# EAGLE design Window Dehumidifier Upgrade Board (EAGLE 7.6.0)
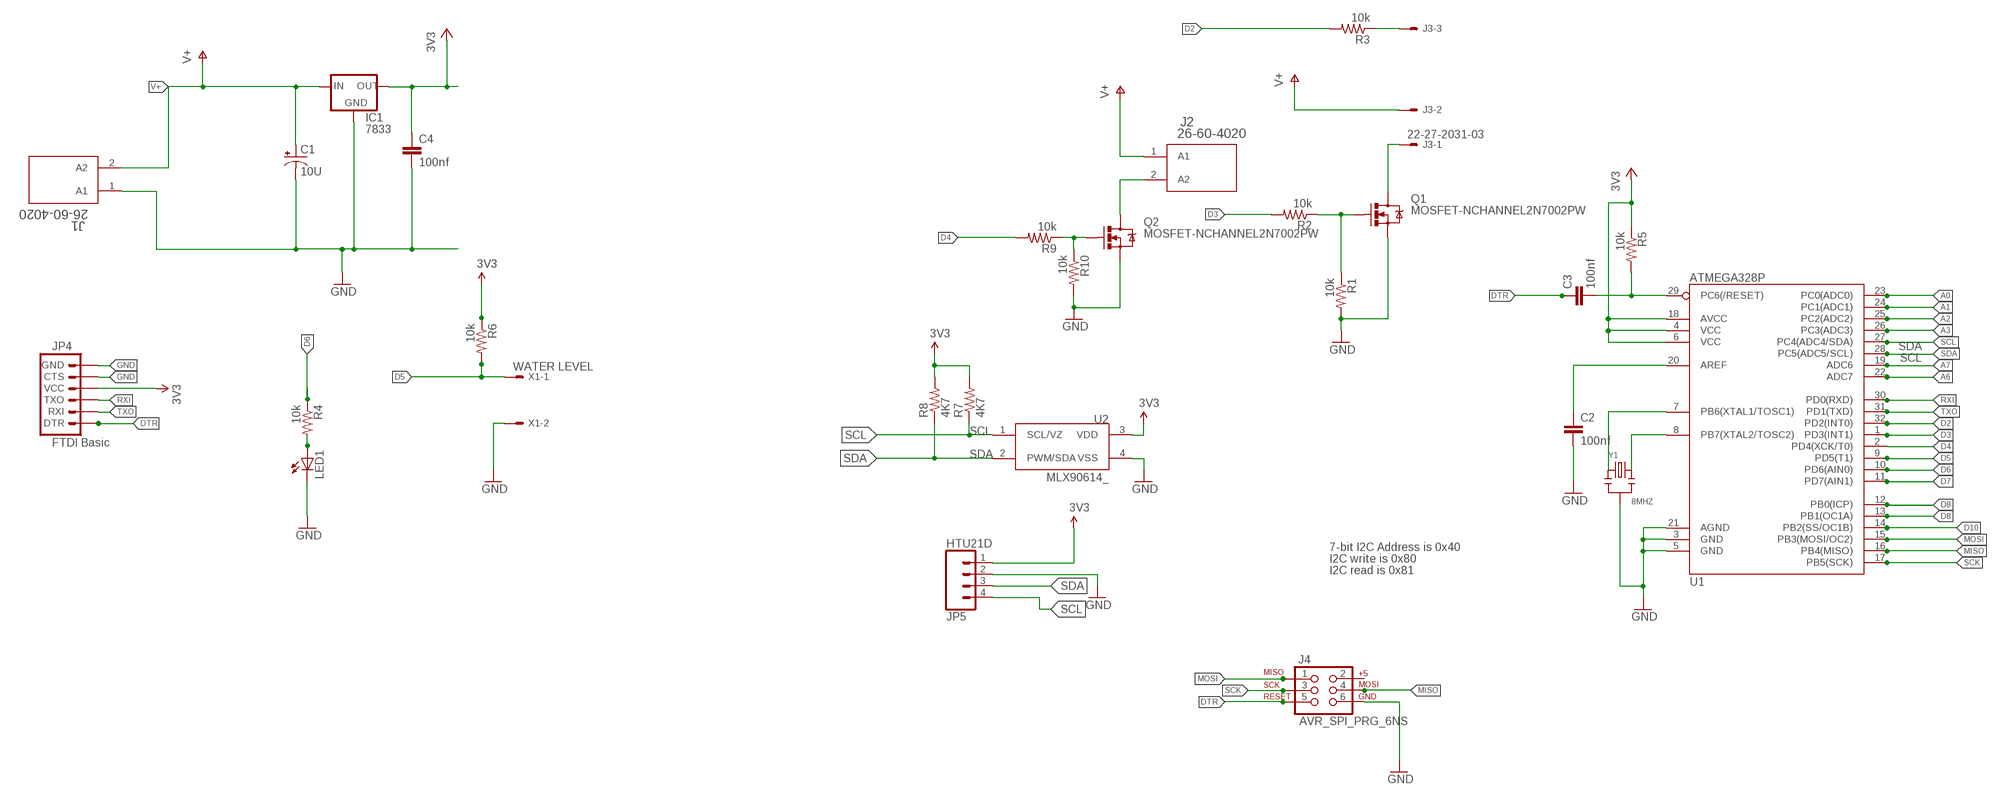
[diagram p0: schematic, sheet 1]

## Parts
C1  10U  CAP_POLPTH1  [CPOL-RADIAL-100UF-25V]
C2  100nf  CAP0805  [0805]
C3  100nf  CAP0805  [0805]
C4  100nf  CAP0805  [0805]
IC1  7833  V_REG_78XXTO-92  [TO-92]
J1  26-60-4020  [26-60-4020]
J2  26-60-4020  [26-60-4020]
J3  22-27-2031-03  [6410-03]
J4  AVR_SPI_PRG_6NS  [2X3-NS]
JP4  FTDI Basic  ARDUINO_SERIAL_PROGRAMPTH  [1X06]
JP5  HTU21D  M04PTH  [1X04]
LED1  LED3MM  [LED3MM]
Q1  MOSFET-NCHANNEL2N7002PW  [SOT323]
Q2  MOSFET-NCHANNEL2N7002PW  [SOT323]
R1  10k  RESISTOR  [0805]
R2  10k  RESISTOR  [0805]
R3  10k  RESISTOR  [0805]
R4  10k  RESISTOR  [0805]
R5  10k  RESISTOR  [0805]
R6  10k  RESISTOR  [0805]
R7  4K7  RESISTOR  [0805]
R8  4K7  RESISTOR  [0805]
R9  10k  RESISTOR  [0805]
R10  10k  RESISTOR  [0805]
U1  ATMEGA328P  ATMEGA328_SMT  [TQFP32-08]
U2  MLX90614_  [TO-39]
X1  WATER LEVEL  22-23-2021  [22-23-2021]
Y1  8MHZ  DIP-CERAMIC-RESONATOR/-OSCILLATOR-8MHZ(3P-2.5-8X3MM)  [X3-2.5-8X3X5.5MM]

## Nets
3.3V: JP4.4(VCC) ; supply symbol labelled 3V3
3V3: C4.1 IC1.3(OUT) JP5.1 R5.1 R6.1 R7.2 R8.2 U1.4(VCC) U1.6(VCC) U1.18(AVCC) U2.3(VDD)
A0: U1.23(PC0(ADC0))
A1: U1.24(PC1(ADC1))
A2: U1.25(PC2(ADC2))
A3: U1.26(PC3(ADC3))
A6: U1.22(ADC7)
A7: U1.19(ADC6)
D2: R3.2 U1.32(PD2(INT0))
D3: R2.2 U1.1(PD3(INT1))
D4: R9.2 U1.2(PD4(XCK/T0))
D5: R6.2 U1.9(PD5(T1)) X1.1
D6: R4.1 U1.10(PD6(AIN0))
D7: U1.11(PD7(AIN1))
D8: U1.12(PB0(ICP))
D9: U1.13(PB1(OC1A))
D10: U1.14(PB2(SS/OC1B))
DTR: C3.1 J4.5 JP4.1(DTR)
GND [vcc]: C1.2(-) C2.2 C4.2 IC1.1(GND) J1.1(A1) J4.6 JP4.5(CTS) JP4.6(GND) JP5.2 LED1.K(C) Q1.2(S) Q2.2(S) R1.2 R10.2 U1.3(GND) U1.5(GND) U1.21(AGND) U2.4(VSS) X1.2 Y1.2
MISO: J4.4 U1.16(PB4(MISO))
MOSI: J4.1 U1.15(PB3(MOSI/OC2))
N$3: Q2.1(G) R9.1 R10.1
N$4: J2.2(A2) Q2.3(D)
N$5: Q1.1(G) R1.1 R2.1
N$6: J3.1 Q1.3(D)
N$7: LED1.A R4.2
N$8: J3.3 R3.1
N$9: C2.1 U1.20(AREF)
N$10: C3.2 R5.2 U1.29(PC6(/RESET))
N$11: U1.7(PB6(XTAL1/TOSC1)) Y1.1
N$12: U1.8(PB7(XTAL2/TOSC2)) Y1.3
RXI: JP4.3(TXO) U1.30(PD0(RXD))
SCK: J4.3 U1.17(PB5(SCK))
SCL: JP5.4 R7.1 U1.28(PC5(ADC5/SCL)) U2.1(SCL/VZ)
SDA: JP5.3 R8.1 U1.27(PC4(ADC4/SDA)) U2.2(PWM/SDA)
TXO: JP4.2(RXI) U1.31(PD1(TXD))
V+: C1.1(+) IC1.2(IN) J1.2(A2) J2.1(A1) J3.2
Unconnected: J4.2

## Notes on the sheet
- 7-bit I2C Address is 0x40
- I2C write is 0x80
- I2C read is 0x81

## Library data of the parts
C1 = SparkFun-Passives:CAP_POL: Capacitor Polarized These are standard SMD and PTH capacitors. Normally 10uF, 47uF, and 100uF in electrolytic and tantalum varieties. Always verify the external diameter of the through hole cap, it varies with capacity, voltage, and manufacturer. The EIA devices should be standard.
C2-C4 = SparkFun-Passives:CAP: Capacitor Standard 0603 ceramic capacitor, and 0.1" leaded capacitor.
IC1 = SparkFun-PowerIC:V_REG_78XX: Voltage Regulator Standard 7805 5V regulator. IGO (Input Ground Output). Spark Fun Electronics SKU : COM-00107
J1 J2 = Molex 26604020:26-60-4020; MANUFACTURER_PART_NUMBER: 26604020; VENDOR: Tyco Electronics
J3 = con-molex:22-?-03: CONNECTOR wire to board 2.54 mm (.1 inch) pitch header; OC_FARNELL: unknown; OC_NEWARK: unknown
J4 = SparkFun-Connectors:AVR_SPI_PRG_6: AVR ISP 6 Pin This is the reduced ISP connector for AVR programming. Common on Arduino. This footprint will take up less PCB space and can be used with a 10-pin to 6-pin adapter such as SKU: BOB-08508
JP4 = SparkFun:ARDUINO_SERIAL_PROGRAM
JP5 = SparkFun-Connectors:M04: Header 4 Standard 4-pin 0.1" header. Use with straight break away headers (SKU : PRT-00116), right angle break away headers (PRT-00553), swiss pins (PRT-00743), machine pins (PRT-00117), and female headers (PRT-00115). Molex polarized connector foot print use with SKU : PRT-08231 with associated crimp pins and housings. 1MM SMD Version SKU: PRT-10208
LED1 = SparkFun-LED:LED: LEDs Standard schematic elements and footprints for 5mm, 3mm, 1206, and 0603 sized LEDs. 5mm - Spark Fun Electronics SKU : COM-00529 (and others)
Q1 Q2 = SparkFun-DiscreteSemi:MOSFET-NCHANNEL: Common NMOSFET Parts MFG P/N Store ID Prod ID FDD8780 TRANS-09984 SI7820DN TRANS-11055 FDS6630A IC-08089 2N7002PW TRANS-11151 FQP30N06L COM-10213 TRANS-10060 BSS123LT1G TRANS-08345 BSS138 TRANS-00830 BS170 2N7000; PROD_ID: TRANS-11151
R1-R10 = SparkFun:RESISTOR: Resistor Basic schematic elements and footprints for 0603, 1206, and PTH 1/10th watt (small) resistors.
U1 = SparkFun-DigitalIC:ATMEGA328_SMT: 32-Pin Atmega328 part Commonly used on Arduino compatible boards Available in QFP and QFN packages TQFP is IC-09069 QFN is non-stock; PROD_ID: IC-09069
U2 = SparkFun-Sensors:MLX90614: Non-contact PIR I2C interface temperature sensor
X1 = con-molex:22-23-2021: .100" (2.54mm) Center Header - 2 Pin; MF: MOLEX; MPN: 22-23-2021; OC_FARNELL: 1462926; OC_NEWARK: 25C3832
Y1 = Seeed-OPL-Crystal-Oscillator:DIP-CERAMIC-RESONATOR/-OSCILLATOR-8MHZ(3P-2.5-8X3MM): 306030010; MPN: CSTLS8M00G53Z-A0

## Net classes
0 default: width 0.203 mm
1 vcc: width 0.254 mm

## Board
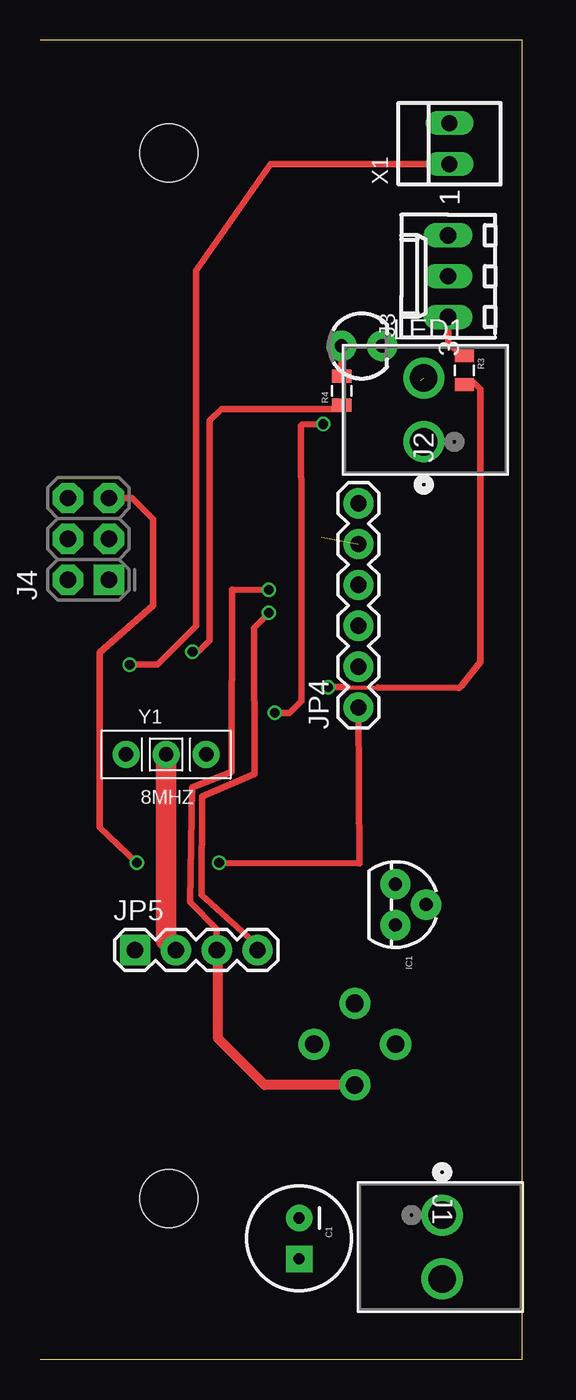
[diagram p1: board, top side]
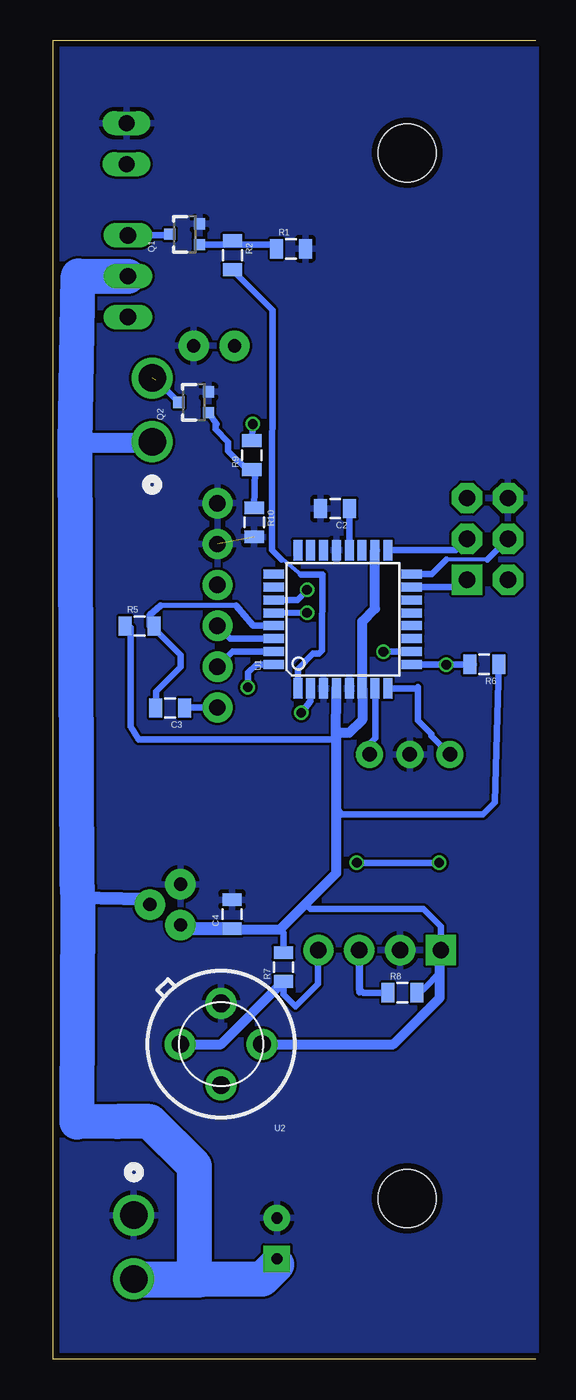
[diagram p2: board, bottom side, seen from below]

Size 30 x 82 mm. Coordinates in mm from the lower left corner, seen from the top.
Outline: 0,0 30,0 30,82 0,82
Copper layers (1*16): Top 0.035559375mm / dielectric 1.6mm / Bottom 0.035559375mm
Design rules "oshpark-2layer": minimum track width 6mil, minimum drill 10mil, track to track 6mil, track to pad 6mil, pad to pad 6mil, via to via 6mil, smd to smd 6mil, copper to edge 15mil, drill to drill 6mil, minimum pad ring 5mil, minimum via ring 5mil, stop-mask expansion 2.5mil, vias tented up to drill 0mil, thermal gap 10mil
Holes 3.6 mm at 8,10 8,75

### Footprints (pad centres in the part's own frame; a part is rotated, then mirrored left to right if it is on the bottom)
CPOL-RADIAL-100UF-25V = drill 0.7 pad 1.651 square: 1 1.27,0 | drill 0.7 pad 1.651: 2 -1.27,0
0805 = smd 0.8 x 1.2: 1 -0.9,0; 2 0.9,0
TO-92 = drill 0.813 pad 1.88: 1 -1.27,0; 2 0,1.905; 3 1.27,0
26-60-4020 = drill 1.702 pad 2.21: 1 -3.962,0; 2 0,0
6410-03 = drill 1.016 long: 1 2.54,0; 2 0,0; 3 -2.54,0
2X3-NS = drill 1.016 pad 1.88 square: 1 -2.54,-1.27 | drill 1.016 pad 1.88 octagon: 2 -2.54,1.27; 3 0,-1.27; 4 0,1.27; 5 2.54,-1.27; 6 2.54,1.27
1X06 = drill 1.016 pad 1.88: 1 0,0; 2 2.54,0; 3 5.08,0; 4 7.62,0; 5 10.16,0; 6 12.7,0
1X04 = drill 1.016 pad 1.88 square: 1 0,0 | drill 1.016 pad 1.88: 2 2.54,0; 3 5.08,0; 4 7.62,0
LED3MM = drill 0.813 pad 1.88: A -1.27,0; K 1.27,0
SOT323 = smd 0.7 x 0.7: 1 -0.65,-0.925; 2 0.65,-0.925; 3 0,0.925
TQFP32-08 = smd 1.27 x 0.559: 1 -4.293,2.8; 2 -4.293,2; 3 -4.293,1.2; 4 -4.293,0.4; 5 -4.293,-0.4; 6 -4.293,-1.2; 7 -4.293,-2; 8 -4.293,-2.8; 17 4.293,-2.8; 18 4.293,-2; 19 4.293,-1.2; 20 4.293,-0.4; 21 4.293,0.4; 22 4.293,1.2; 23 4.293,2; 24 4.293,2.8 | smd 0.559 x 1.27: 9 -2.8,-4.293; 10 -2,-4.293; 11 -1.2,-4.293; 12 -0.4,-4.293; 13 0.4,-4.293; 14 1.2,-4.293; 15 2,-4.293; 16 2.8,-4.293; 25 2.8,4.293; 26 2,4.293; 27 1.2,4.293; 28 0.4,4.293; 29 -0.4,4.293; 30 -1.2,4.293; 31 -2,4.293; 32 -2.8,4.293
TO-39 = drill 1.1 pad 1.93: 1 2.54,0; 2 0,2.54; 3 -2.54,0; 4 0,-2.54
22-23-2021 = drill 1 long: 1 -1.27,0; 2 1.27,0
X3-2.5-8X3X5.5MM = drill 0.9 pad 1.676: 1 2.5,0; 2 0,0; 3 -2.5,0

### Placement (x,y rotation side)
C1  16.1,7.51 270 top
C2  12.48,52.89 180 bottom
C3  22.74,40.49 180 bottom
C4  18.89,27.67 90 bottom
IC1  22.1,28.26 270 top
J1  25,5 270 top
J2  23.86,61 90 top
J3  25.37,67.33 90 top
J4  3,51 90 top
JP4  19.8,40.52 90 top
JP5  5.9,25.44 0 top
LED1  20,63 0 top
Q1  21.83,69.94 90 bottom
Q2  21.27,59.5 90 bottom
R1  15.23,69.04 0 bottom
R2  18.86,68.64 270 bottom
R3  26.38,61.48 270 top
R4  18.74,60.21 90 top
R5  24.64,45.59 0 bottom
R6  3.21,43.2 180 bottom
R7  15.68,24.38 90 bottom
R8  8.29,22.79 0 bottom
R9  17.65,56.2 90 bottom
R10  17.51,52.03 270 bottom
U1  12,46 90 bottom
U2  19.57,19.59 180 bottom
X1  25.46,75.57 90 top
Y1  7.83,37.6 0 top

### Tracks (layer width: path | path; a pad name or v marks a point on that pad's centre or on a via)
3V3
  Bottom 0.406: R5.1 25.2,45.49 25.2,39.34 24.69,38.53 12.43,38.53 | 9.98,50.31 U1.18 | R6.1 2.56,34.6 3.28,33.88 12.02,33.88 12.4,34.27 | 22.33,26.76 IC1.3 | R7.2 15.68,26.5 15.9,26.72 | R8.2 7.43,23 7,23 5.9,24.1 JP5.1 5.9,26.9 7,28 14,28 14.31,28.31
  Bottom 0.61: C4.1 18.84,26.72 15.9,26.72 14.31,28.31 12.4,30.22 12.4,34.27 12.4,38.94 | 12.4,38.94 12.43,38.53 U1.4 | 12.4,38.94 11.61,38.94 10.79,39.75 U1.6 10.79,45.87 10,46.67 U1.18 | U2.3 8.86,19.59 5.97,22.48 5.97,25.37 JP5.1
  Bottom 0.813: IC1.3 21.87,26.77 C4.1
D2  (via drill 0.6)
  Top 0.254: 19.11,41.77 21.01,41.77
  Top 0.406: R3.2 26.96,60.73 27.38,60.31 27.38,43.89 | 27.38,43.89 27.38,43.64 | 26.11,41.76 26.19,41.86 | 26.19,41.86 27.37,43.34 27.37,43.73 27.38,43.89 | 26.19,41.86 26.11,41.78 26.04,41.73 21.01,41.77 | v17.91,41.78 19.13,41.78 19.11,41.77
  Bottom 0.406: U1.32 17.38,43.2 17.88,42.7 17.88,41.81 v17.91,41.78
D3
  Bottom 0.254: 15.82,49.71 15.75,49.73 14.61,48.79
  Bottom 0.406: R2.2 18.86,67.7 16.38,65.23 16.41,50.32 15.82,49.71 | 14.61,48.79 13.26,48.79 13.28,44.07 13.49,43.87 13.84,43.87 14.78,42.93 14.78,41.73 U1.1
D4  (via drill 0.6)
  Top 0.406: v14.58,40.18 15.52,40.18 16.26,40.92 16.26,51.54 16.23,58.04 16.28,58.12 v17.6,58.14
  Bottom 0.406: 13.92,41.66 13.97,41.71 U1.2 14,40.91 v14.58,40.18 | v17.6,58.14 17.6,58.05 R9.2
D5  (via drill 0.6)
  Top 0.406: v5.56,43.18 7.32,43.18 9.7,45.57 9.7,67.67 14.33,74.3 25.45,74.3 X1.1
  Bottom 0.406: U1.9 3.86,43.2 R6.2 5.39,43.2 5.51,43.08 | U1.9 5.52,43.2 5.51,43.2 | U1.9 5.58,43.2 v5.56,43.18
D6  (via drill 0.6)
  Top 0.406: v9.47,43.99 9.88,44.02 10.54,44.68 10.54,58.34 11.28,59.08 18.7,59.08 R4.1
  Bottom 0.406: U1.10 9.35,44 v9.47,43.99
DTR  (via drill 0.6)
  Top 0.406: J4.5 5.72,53.54 7.01,52.25 7.01,46.86 3.71,43.94 3.71,33.07 v6.02,30.86 | JP4.1 19.85,30.82 11.51,30.86 v11.12,30.86 11.15,30.89
  Bottom 0.406: JP4.1 21.81,40.52 C3.1 | v11.12,30.86 v6.02,30.86
GND  (1 unrouted)
  Top 1.27: Y1.2 7.83,26.05 JP5.2
  pour Bottom: 0.05,0.05 29.82,0 29.82,81.91 0,81.91 0,0
MISO
  Bottom 0.254: 3.02,49.71 5.56,49.71
  Bottom 0.406: J4.4 3.02,49.71 | 5.56,49.71 6.45,48.82 U1.16
MOSI
  Bottom 0.406: U1.15 4.73,48 J4.1
N$3
  Bottom 0.406: R10.1 17.45,55.3 | 17.45,55.3 17.96,55.3 19.13,56.46 19.13,57.02 19.91,57.81 19.91,58.06 19.84,58.14 Q2.1 | R9.1 17.38,55.53 17.45,55.3
N$4  (1 unrouted)
  Bottom 0.406: 23.65,60.87 Q2.3
N$5
  Bottom 0.406: Q1.1 18.86,69.29 | 18.86,69.29 R2.1 | 18.86,69.29 16.13,69.29 R1.1
N$6
  Bottom 0.406: J3.1 22.82,69.87 Q1.3
N$7
  Top 0.406: R4.2 18.73,60.93 LED1.A
N$8
  Top 0.406: R3.1 25.37,63.06 J3.3
N$9
  Bottom 0.406: U1.20 11.58,50.31 C2.1
N$10
  Bottom 0.305: 18.64,46.86 23.34,46.86
  Bottom 0.406: U1.29 17.58,45.6 18.64,46.86 | 23.34,46.86 24,46.25 24,45.6 R5.2 23.89,45.59 22.1,43.79 22.1,43.03 23.62,41.5 23.62,40.51 C3.2
N$11
  Bottom 0.406: U1.7 9.96,41.66 9.96,38.63 10.33,38.26 Y1.1
N$12
  Bottom 0.406: Y1.3 6.48,38.75 6.48,38.86 7.34,39.73 7.34,41.78 7.42,41.71 U1.8
RXI
  Bottom 0.406: U1.30 19,44.8 JP4.3
SCK
  Bottom 0.406: J4.3 4.98,50.29 U1.17
SCL  (via drill 0.6)
  Top 0.406: JP5.4 13.52,25.72 10.03,28.88 10.08,34.98 13.34,36.4 13.31,45.47 v14.22,46.41
  Bottom 0.406: JP5.4 13.53,25.43 13.53,23.34 14.94,21.93 15.68,22.68 R7.1 | v14.22,46.41 16.26,46.43 U1.28
  Bottom 0.61: U2.1 19.58,19.59 R7.1
SDA  (via drill 0.6)
  Top 0.406: JP5.3 10.98,26 | 10.98,26 10.98,26.77 9.32,28.42 9.46,35.54 11.89,36.5 11.94,47.85 v14.22,47.83 | 10.94,22.79 10.94,24.79 10.94,25.96 10.98,26
  Top 0.61: U2.2 13.97,17.05 11.07,19.94 11.07,24.66 10.94,24.79
  Bottom 0.406: 10.98,22.98 JP5.3 10.94,25.41 10.94,23 10.73,22.79 R8.1 | v14.22,47.83 14.81,47.19 U1.27 | 10.98,22.82 10.98,22.98 | 10.98,22.98 11,23 11,25
TXO
  Bottom 0.406: U1.31 18.85,44 JP4.2
V+
  Bottom 0.813: IC1.2 24.34,28.6 28.45,28.7
  Bottom 1.27: 28.46,67.36 27.99,67.33 | J2.1 23.92,56.97 28.64,56.96
  Bottom 1.422: 16.1,5.9 C1.1 | J1.2 24.95,4.95 | 20.78,4.95 21.23,5.41
  Bottom 2.184: J1.2 17,5 16.1,5.9 | 24.95,4.95 20.78,4.95 | 21.23,5.41 21.23,12.01 24,14.78 26.04,14.78 28.53,14.75 28.45,28.7 28.53,29.7 28.64,56.96 28.46,67.36 | 27.99,67.33 J3.2